# Altium schematic sheet Template_Sensor_schematic.SchDoc
size A
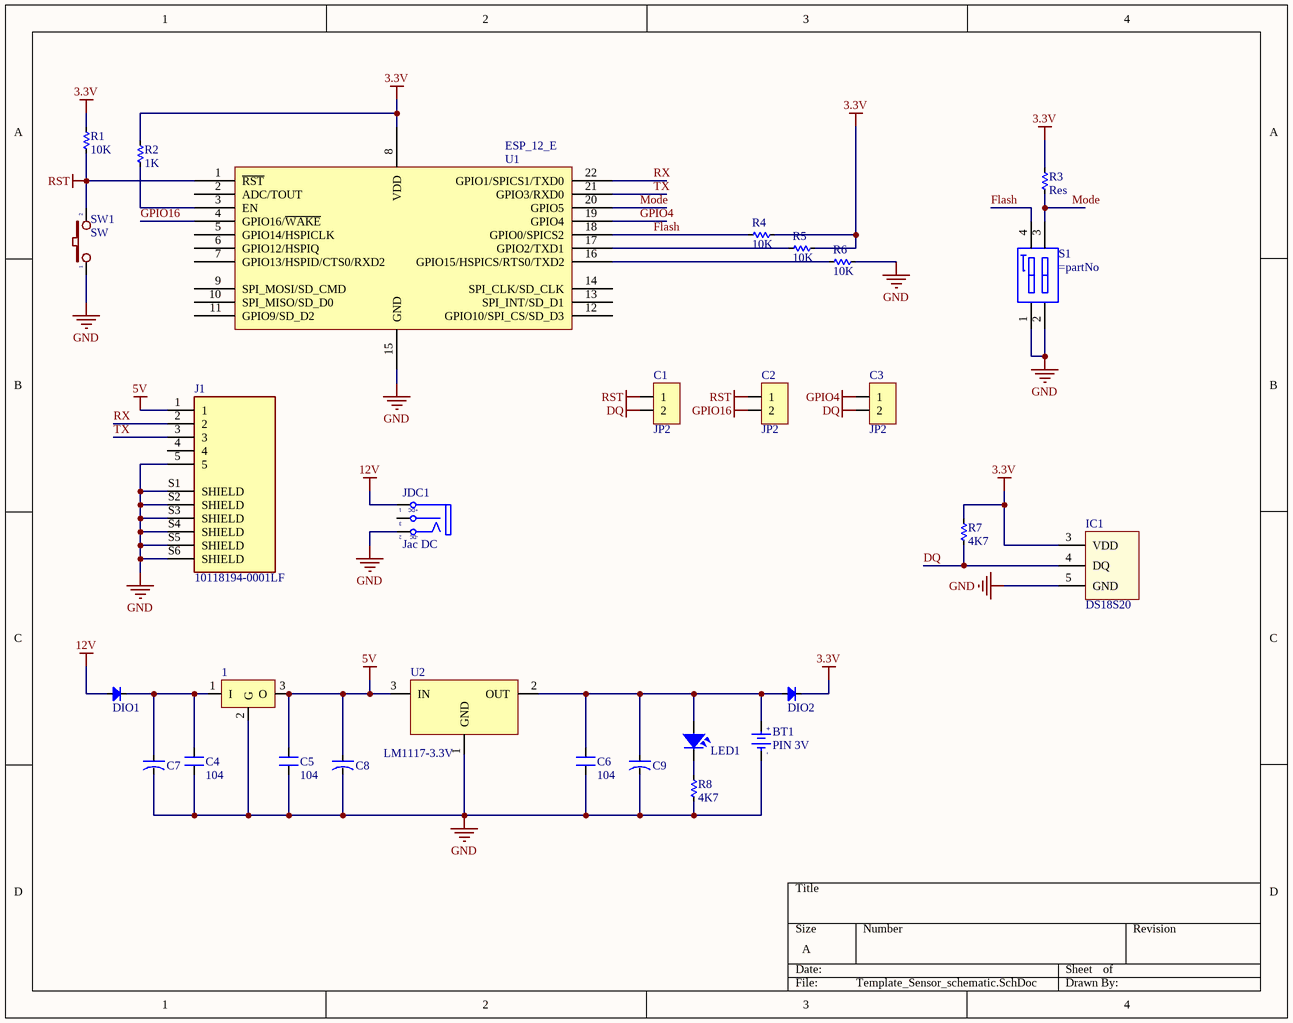
[diagram p0: Template_Sensor_schematic.SchDoc]

## Parts
1  LM78xx  [TO252-123]  (value not drawn)
BT1  PIN 3V  [PIN3V]
C1  JP2  [JP2-D1T]
C2  JP2  [JP2-D1T]
C3  JP2  [JP2-D1T]
C4  104  [SM-CAP-0805]
C5  104  [SM-CAP-0805]
C6  104  [SM-CAP-0805]
C7  CN-ALU-SMD  [CAP-ALU-SMD-4.5x5x1.4]  (value not drawn)
C8  CN-ALU-SMD  [CAP-ALU-SMD-4.5x5x1.4]  (value not drawn)
C9  CN-ALU-SMD  [CAP-ALU-SMD-4.5x5x1.4]  (value not drawn)
DIO1  Diode SMD  [DIO-SMD-106]  (value not drawn)
DIO2  Diode SMD  [DIO-SMD-106]  (value not drawn)
IC1  DS18S20  [DS18S20]
J1  10118194-0001LF  [AMPHENOL_10118194-0001LF]
JDC1  Jac DC  [DC3]
LED1  LED  [LED-0805-Blue]  (value not drawn)
R1  10K  [RES-SMD-0805]
R2  1K  [RES-SMD-0805]
R3  Res  [RES-SMD-0805]
R4  10K  [RES-SMD-0805]
R5  10K  [RES-SMD-0805]
R6  10K  [RES-SMD-0805]
R7  4K7  [RES-SMD-0805]
R8  4K7  [RES-SMD-0805]
S1  (no value)  [SW-DIP2]
SW1  SW  [SW1-SMD]
U1  ESP_12_E  [ESP_12_E]
U2  LM1117-3.3V  [SOT223]

## Nets
3.3V: DIO2.2(K) IC1.3(VDD) R1.1 R2.1 R3.1 R4.1 R5.1 R7.1 U1.8(VDD)
5V: 1.3(O) C5.2 C8.1 J1.1 U2.3(IN)
12V: DIO1.1(A) JDC1.1(T)
DQ: C1.2 C3.2 IC1.4(DQ) R7.2
GND: 1.2(G) BT1.2(GND) C4.1 C5.1 C6.1 C7.2 C8.2 C9.2 IC1.5(GND) J1.5 J1.S1(SHIELD) J1.S2(SHIELD) J1.S3(SHIELD) J1.S4(SHIELD) J1.S5(SHIELD) J1.S6(SHIELD) JDC1.2(TN) R6.1 R8.2 S1.1 S1.2 SW1.1 U1.15(GND) U2.1(GND)
GPIO4: C3.1 U1.19(GPIO4)
GPIO16: C2.2 U1.4(GPIO16/~{WAKE})
RST: C1.1 C2.1 R1.2 SW1.2 U1.1(~{RST})
Flash: R4.2 S1.4 U1.18(GPIO0/SPICS2)
Mode: R3.2 S1.3 U1.20(GPIO5)
RX: J1.2 U1.22(GPIO1/SPICS1/TXD0)
TX: J1.3 U1.21(GPIO3/RXD0)
Net1_1: 1.1(I) C4.2 C7.1 DIO1.2(K)
NetBT1_1: BT1.1(+3V) C6.2 C9.1 DIO2.1(A) LED1.1 U2.2(OUT)
NetLED1_2: LED1.2 R8.1
NetR2_2: R2.2 U1.3(EN)
NetR5_2: R5.2 U1.17(GPIO2/TXD1)
NetR6_2: R6.2 U1.16(GPIO15/HSPICS/RTS0/TXD2)

Not connected (* = marked no-connect by the designer): J1 4; JDC1 3(S); U1 2(ADC/TOUT) 5(GPIO14/HSPICLK) 6(GPIO12/HSPIQ) 7(GPIO13/HSPID/CTS0/RXD2) 9(SPI_MOSI/SD_CMD) 10(SPI_MISO/SD_D0) 11(GPIO9/SD_D2) 12(GPIO10/SPI_CS/SD_D3) 13(SPI_INT/SD_D1) 14(SPI_CLK/SD_CLK)

## Notes on the sheet
- (in symbol DCIN) +DC; -DC
- (in symbol PIN 3V) +; -

## Library data of the parts
1 = LM78xx: Positive Voltage Regulator; Note: Tab is connected to pin 3 (GND).; Published: 24-Aug-2001; LatestRevisionDate: 17-Jul-2002; LatestRevisionNote: Re-released for DXP Platform.; DatasheetVersion: Apr-1994; PackageVersion: Jul-1998; PackageReference: ISOWATT220AB; Publisher: Altium Limited; PackageDescription: TO, Thru-Hole, Vertical, Heatsink Mounted; 3 In-Line Leads; Pitch 2.54 mm; Pin sequence 1, 3, 2; ComponentLink1Description: Manufacturer Link; ComponentLink1URL: http://www.st.com/; ComponentLink2Description: Datasheet; ComponentLink2URL: http://www.st.com/stonline/products/literature/ds/2146/l78m05c.pdf
BT1 = PIN 3V: Battery 3VDC; Value: PIN 3V
C1-C3 = JP2: WR-PHD 2.54 mm Angled Socket Header; Manufacturer: W¨¹rth Elektronik eiSos GmbH; partNo: 613002143121; ComponentLink1 Description: Manufacturer; ComponentLink2 Description: Datasheet; NoPins: 02; Created Date: 29 March 2013; ComponentLink1URL: http://www.we-online.com; ComponentLink2URL: http://katalog.we-online.de/em/datasheet/6130xx143121.pdf; Created by: Karrer Zheng
C4-C6 = CN: Value: 0,1uF/300V; Designed by: VanDungEvn
C7-C9 = CN-ALU-SMD: Polarized Capacitor (Axial); Published: 8-Jun-2000; LatestRevisionDate: 17-Jul-2002; LatestRevisionNote: Re-released for DXP Platform.; PackageReference: POLAR0.8; Publisher: Altium Limited
DIO1 DIO2 = Diode SMD: Default Diode; Code - JEDEC: DO-214-AB; Value: 1N5007; Published: 8-Jun-2000; Revision: July-2002: Re-released for DXP Platform.; Publisher: Altium Limited
IC1 = DS18S20: High Precision  1-Wire® Digital Thermometer
J1 = 10118194-0001LF: USB - micro B USB 2.0 Receptacle Connector 5 Position Surface Mount, Right Angle; Through Hole; MF: Amphenol ICC; Package: None; Price: None; Availability: Unavailable; MP: 10118194-0001LF; SnapEDA_Link: https://www.snapeda.com/parts/10118194-0001LF/Amphenol%20FCI/view-part/1413308/?ref=snap; Value: *
JDC1 = DCIN: Jac DC input; Value: Jac DC
LED1 = LED SMD: Value: LED 3 - 5 ly 2 Colour
R1-R8 = Res-SMD: Resistor; Manufacturer: Generic Components; Class: Passive; Published: 08/06/2000; Publisher: Altium Hobart Technology Centre
S1 = SWDIP2: WS-DITV 2.54 mm small compact THT flat actuator with top tape; Manufacturer: Wurth Elektronik; Part No.: 418127160902; ComponentLink1 Description: Manufacturer; ComponentLink2 Description: Datasheet; Pole: 02; Created Date: Dec.2015; ComponentLink1URL: http://www.we-online.com; ComponentLink2URL: http://katalog.we-online.de/em/datasheet/4181271609xx.pdf; Created by: Baojun Chen
SW1 = SW2: Switch button 2 pin; Value: SW chip 2 pin
U1 = ESP_12_E: ESP-12 Wi-Fi Module by AI-Thinker; IC: ESP8266-EX; Vendor: Ai-thinker
U2 = LM1117: 800mA Low-Dropout Linear Regulator; Creator: Nguyen Ba Bien; Website: http://group3i.net